# Altium project EEG.PrjPCB
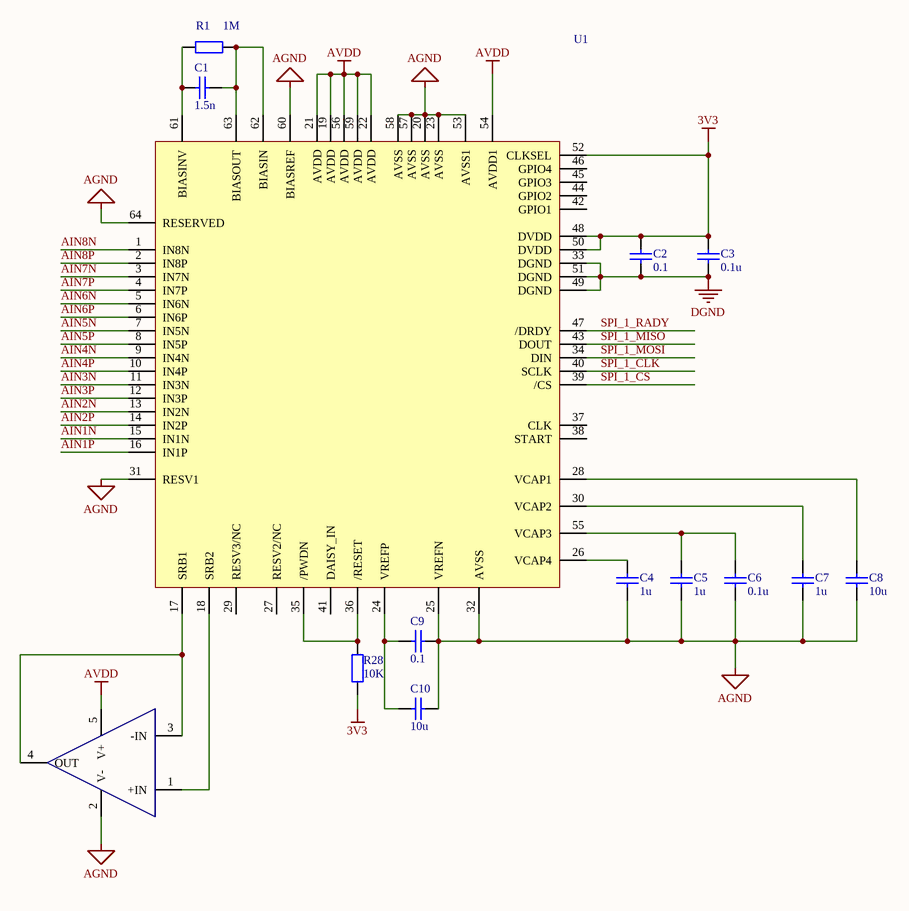
[diagram p0: ADC.SchDoc]
4 sheets, 89 parts. Net scope: global (net labels, ports and power ports of the same name join across sheets).
Sheets:
  ADC.SchDoc
  MPU.SchDoc
  INTERFACE.SchDoc
  Power.SchDoc

## Sheet ADC.SchDoc
size A4

### Parts
(Parts that share a designator on the sheet are numbered #1, #2 ... from top to bottom, then left to right.)
?#1  LTC2054MPS5  [S5]  (value not drawn)
C1  1.5n  [RAD-0.3]
C2  0.1  [CAP-C0603-H0.9mm]
C3  0.1u  [CAP-C0603-H0.9mm]
C4  1u  [CAP-C0603-H0.9mm]
C5  1u  [CAP-C0603-H0.9mm]
C6  0.1u  [CAP-C0603-H0.9mm]
C7  1u  [CAP-C0603-H0.9mm]
C8  10u  [CAP-C0603-H0.9mm]
C9  0.1  [CAP-C0603-H0.9mm]
C10  10u  [CAP-C0603-H0.9mm]
R1  1M  [RES-0805-H0.6mm]
R28  10K  [RES-0805-H0.6mm]
U1  ADS1299  [TQFP-64]  (value not drawn)

### Nets
3V3: C2.1 C2.2 C3.1 C3.2 R28.2 U1.33(DGND) U1.48(DVDD) U1.49(DGND) U1.50(DVDD) U1.51(DGND) U1.52(CLKSEL)  [also labelled DGND]  [project net CD]
AGND: ?#1.2(V-) C4.2 C5.2 C6.2 C7.2 C8.2 C9.1 C10.1 U1.20(AVSS) U1.23(AVSS) U1.25(VREFN) U1.31(RESV1) U1.32(AVSS) U1.53(AVSS1) U1.57(AVSS) U1.58(AVSS) U1.60(BIASREF) U1.64(RESERVED)
AVDD: ?#1.5(V+) U1.19(AVDD) U1.21(AVDD) U1.22(AVDD) U1.54(AVDD1) U1.56(AVDD) U1.59(AVDD)  [project net +2.5V]
AIN1N: U1.15(IN1N)
AIN1P: U1.16(IN1P)
AIN2N: U1.13(IN2N)
AIN2P: U1.14(IN2P)
AIN3N: U1.11(IN3N)
AIN3P: U1.12(IN3P)
AIN4N: U1.9(IN4N)
AIN4P: U1.10(IN4P)
AIN5N: U1.7(IN5N)
AIN5P: U1.8(IN5P)
AIN6N: U1.5(IN6N)
AIN6P: U1.6(IN6P)
AIN7N: U1.3(IN7N)
AIN7P: U1.4(IN7P)
AIN8N: U1.1(IN8N)
AIN8P: U1.2(IN8P)
SPI_1_CLK: U1.40(SCLK)
SPI_1_CS: U1.39(/CS)
SPI_1_MISO: U1.43(DOUT)
SPI_1_MOSI: U1.34(DIN)
SPI_1_RADY: U1.47(/DRDY)
Net?#1_1: ?#1.1(+IN) U1.18(SRB2)
Net?#1_3: ?#1.3(-IN) ?#1.4(OUT) U1.17(SRB1)
NetC1_1: C1.1 R1.2 U1.61(BIASINV)
NetC1_2: C1.2 R1.1 U1.62(BIASIN) U1.63(BIASOUT)
NetC4_1: C4.1 U1.26(VCAP4)
NetC5_1: C5.1 C6.1 U1.55(VCAP3)
NetC7_1: C7.1 U1.30(VCAP2)
NetC8_1: C8.1 U1.28(VCAP1)
NetC9_2: C9.2 C10.2 U1.24(VREFP)
NetR28_1: R28.1 U1.35(/PWDN) U1.36(/RESET)

Not connected (* = marked no-connect by the designer): U1 27(RESV2/NC) 29(RESV3/NC) 37(CLK) 38(START) 41(DAISY_IN) 42(GPIO1) 44(GPIO2) 45(GPIO3) 46(GPIO4)

### Library data of the parts
?#1 = OPA376DCK: IC OPAMP CHOPPER 500KHZ TSOT23-5; Manufacturer: Linear Technology/Analog Devices; Manufacturer Part Number: LTC2054MPS5#TRMPBF; Amplifier Type: Zero-Drift; Output Type: Rail-to-Rail; Slew Rate: 0.5 V/µs; Current - Supply: 145µA; Voltage - Supply, Single/Dual (±): 2.7 V ~ 6 V; Supplier 1: Digi-Key; RoHS: RoHS Compliant; Category: Integrated Circuits (ICs); Stock 1: 929; Pricing 1: 1=13.95, 25=12.454, 100=7.4993, 250=6.87432 (CAD); Packaging: Cut Tape (CT); Part Status: Active; Operating Temperature: -55°C ~ 150°C; Mounting Type: Surface Mount; Package / Case: SOT-23-5 Thin, TSOT-23-5; Supplier Device Package: TSOT-23-5; Base Part Number: LTC2054; ComponentLink1URL: http://www.linear.com/docs/5176; ComponentLink1Description: http://www.linear.com/docs/5176; Supplier Part Number 1: LTC2054MPS5#TRMPBFCT-ND
C1 = Cap: Capacitor
C2-C10 = C0603: CER 10UF 25V X8R 1210; Supplier 1: Digi-Key; Supplier Part Number 1: 445-174833-1-ND; digikey part number: 478-1244-1-ND; Parameter 1: *
R1 R28 = R: RES SMD 33 OHM 1% 1/10W 0603; CMT: 1k; Supplier 1: Digi-Key; Supplier Part Number 1: 311-33.0HRCT-ND
U1 = ADS1299: ComponentLink1Description: EEG BOARD; ComponentLink1URL: https://www.digikey.ca/products/en/development-boards-kits-programmers/evaluation-and-demonstration-boards-and-kits/787?k=ads1299; ComponentLink2Description: ADS1299; ComponentLink2URL: https://www.digikey.ca/product-detail/en/texas-instruments/ADS1299IPAGR/296-34818-1-ND/3536905; digikey: 296-34818-1-ND

## Sheet MPU.SchDoc
size A4
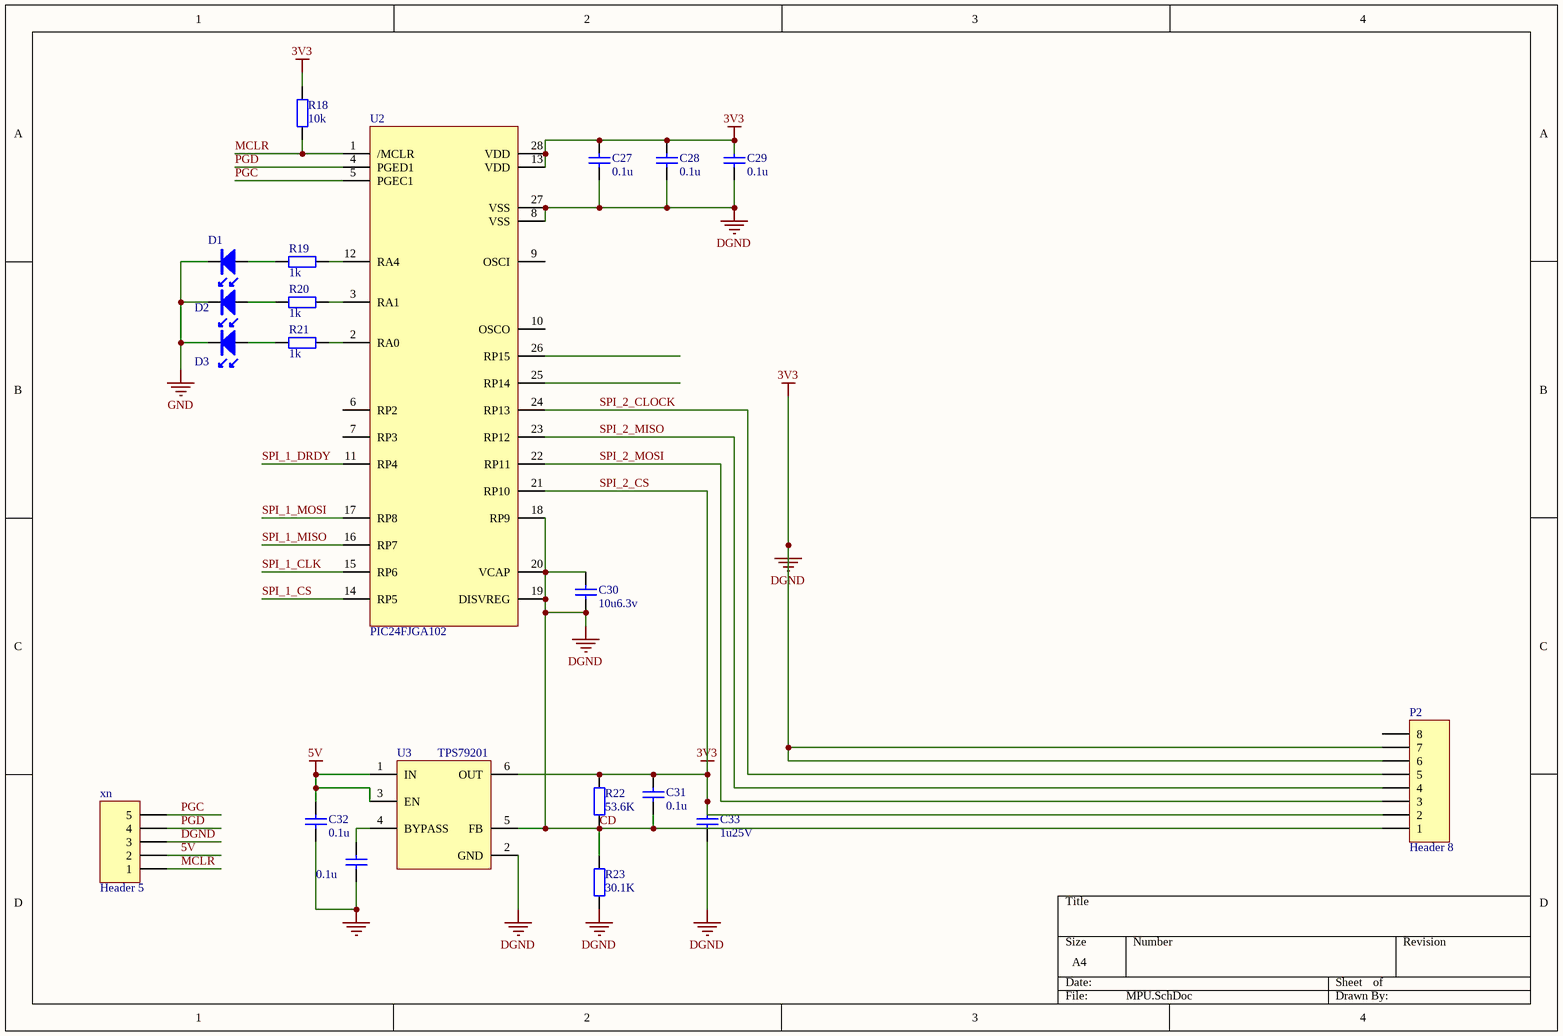
[diagram p1: MPU.SchDoc]

### Parts
(Parts that share a designator on the sheet are numbered #1, #2 ... from top to bottom, then left to right.)
?#2  0.1u  [CAP-C0603-H0.9mm]
C27  0.1u  [CAP-C1210-H2.2MM]
C28  0.1u  [CAP-C1210-H2.2MM]
C29  0.1u  [CAP-C1210-H2.2MM]
C30  10u6.3v  [CAP-C1210-H2.2MM]
C31  0.1u  [CAP-C0603-H0.9mm]
C32  0.1u  [CAP-C0603-H0.9mm]
C33  1u25V  [CAP-C1210-H2.2MM]
D1  LED  [LED0603]  (value not drawn)
D2  LED  [LED0603]  (value not drawn)
D3  LED  [LED0603]  (value not drawn)
P2  Header 8  [HDR1X8]
R18  10k  [RES-0805-H0.6mm]
R19  1k  [R0603]
R20  1k  [R0603]
R21  1k  [R0603]
R22  53.6K  [R0603]
R23  30.1K  [R0603]
U2  PIC24FJGA102
U3  TPS79201
xn  Header 5  [HDR1X5]

### Nets
5V: C32.2 U3.1(IN) U3.3(EN) xn.2
CD: C27.1 C27.2 C28.1 C28.2 C29.1 C29.2 C30.1 C30.2 C31.1 C31.2 C33.1 C33.2 P2.1 P2.2 P2.6 P2.7 R18.2 R22.1 R22.2 R23.1 R23.2 U2.8(VSS) U2.13(VDD) U2.18(RP9) U2.19(DISVREG) U2.20(VCAP) U2.21(RP10) U2.27(VSS) U2.28(VDD) U3.2(GND) U3.5(FB) U3.6(OUT) xn.3  [also labelled 3V3, DGND, SPI_2_CS]
GND: ?#2.1 C32.1 D1.K D2.K D3.K
MCLR: R18.1 U2.1(/MCLR) xn.1
PGC: U2.5(PGEC1) xn.5
PGD: U2.4(PGED1) xn.4
SPI_1_CLK: U2.15(RP6)
SPI_1_CS: U2.14(RP5)
SPI_1_DRDY: U2.11(RP4)
SPI_1_MISO: U2.16(RP7)
SPI_1_MOSI: U2.17(RP8)
SPI_2_CLOCK: P2.5 U2.24(RP13)
SPI_2_MISO: P2.4 U2.23(RP12)
SPI_2_MOSI: P2.3 U2.22(RP11)
Net?#2_2: ?#2.2 U3.4(BYPASS)
NetD1_A: D1.A R19.1
NetD2_A: D2.A R20.1
NetD3_A: D3.A R21.1
NetR19_2: R19.2 U2.12(RA4)
NetR20_2: R20.2 U2.3(RA1)
NetR21_2: R21.2 U2.2(RA0)

Not connected (* = marked no-connect by the designer): P2 8; U2 6(RP2) 7(RP3) 9(OSCI) 10(OSCO) 25(RP14) 26(RP15)

### Library data of the parts
?#2 C31 C32 = C0603: CAP CER 0.1UF 50V 10% X8R 0603; Supplier Part Number 1: 445-8818-1-ND
  ?#2: Supplier 1: Digi-Key
  C31: Supplier 1: Digi-Key; digikey part number: 478-1244-1-ND
  C32: digikey part number: 478-1244-1-ND
C27-C30 C33 = C0603: CER 10UF 25V X8R 1210
  C27-C29 C33: Supplier 1: Digi-Key; Supplier Part Number 1: 445-174833-1-ND
  C30: digikey part number: 445-11185-1-ND; ComponentLink1Description: digikey link; ComponentLink1URL: https://www.digikey.ca/product-detail/en/tdk-corporation/C1608JB0J106K080AB/445-11185-1-ND/3952851
D1-D3 = LED_RED_CLEAR_0603: LED GREEN CLEAR 0603 SMD; CMT: APT2012LVBC/D; Supplier 1: Digi-Key; Supplier Part Number 1: 732-4971-1-ND
P2 = Header 8: Header, 8-Pin; ComponentLink1Description: digikey link; ComponentLink1URL: https://www.digikey.ca/product-detail/en/adafruit-industries-llc/254/1528-1462-ND/5761230; digikey  part number: 1528-1462-ND
R18 = R: RES SMD 33 OHM 1% 1/10W 0603; CMT: 1k; Supplier 1: Digi-Key; Supplier Part Number 1: 311-33.0HRCT-ND
R19-R21 = R0603M: 1K OHM 1% 1/10W 0603; Supplier 1: Digi-Key; Supplier Part Number 1: 311-1.00KHRCT-ND; CMT: 1k
R22 = R0603M: 169k OHM 1% 1/10W 0603; CMT: 100k; Supplier 1: Digi-Key; Supplier Part Number 1: 311-174KHRCT-ND
R23 = R0603M: SMD 39K OHM 1% 1/10W 0603; CMT: 31.6k; Supplier 1: Digi-Key; Supplier Part Number 1: P39.0KHCT-ND
xn = Header 5: Header, 5-Pin; digkey part number: AE10383-ND; ComponentLink2Description: digigkey link; ComponentLink2URL: https://www.digikey.ca/product-detail/en/assmann-wsw-components/A-2004-1-4-LP-N-R/AE10383-ND/2183634
U2 = PIC24FJGA102: ComponentLink1Description: digikey link; ComponentLink1URL: https://www.digikey.ca/product-detail/en/microchip-technology/PIC24FJ64GA102-I-SS/PIC24FJ64GA102-I-SS-ND/2651318; digikey part number: PIC24FJ64GA102-I/SS-ND
U3 = TPS79201: digikey part number: 296-11868-1-ND

## Sheet INTERFACE.SchDoc
size A4
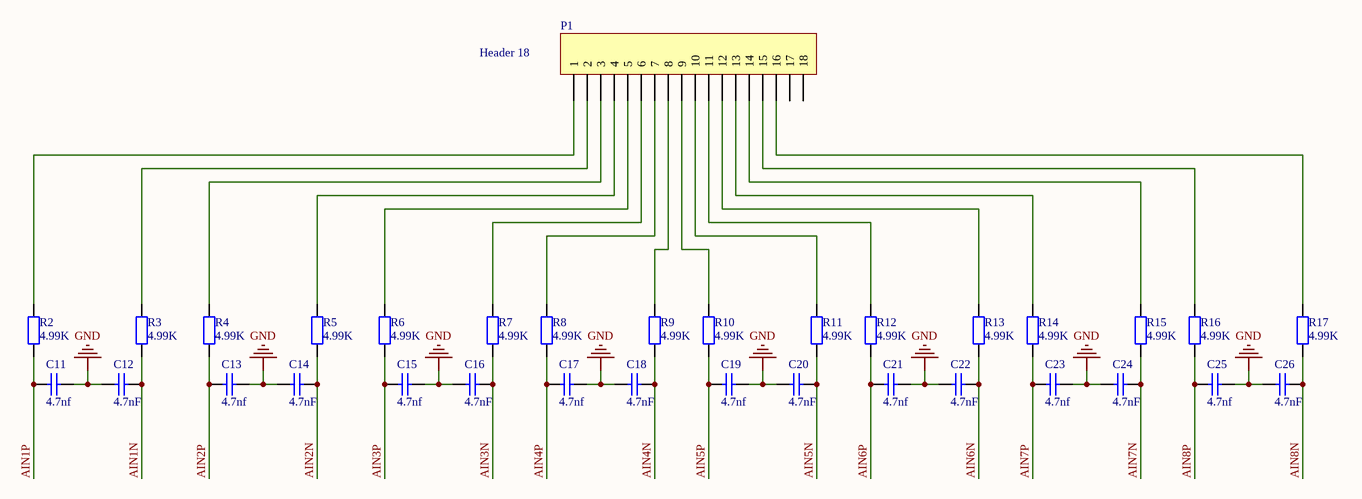
[diagram p2: INTERFACE.SchDoc]

### Parts
C11  4.7nf  [CAP-C0603-H0.9mm]
C12  4.7nF  [CAP-C0603-H0.9mm]
C13  4.7nf  [CAP-C0603-H0.9mm]
C14  4.7nF  [CAP-C0603-H0.9mm]
C15  4.7nf  [CAP-C0603-H0.9mm]
C16  4.7nF  [CAP-C0603-H0.9mm]
C17  4.7nf  [CAP-C0603-H0.9mm]
C18  4.7nF  [CAP-C0603-H0.9mm]
C19  4.7nf  [CAP-C0603-H0.9mm]
C20  4.7nF  [CAP-C0603-H0.9mm]
C21  4.7nf  [CAP-C0603-H0.9mm]
C22  4.7nF  [CAP-C0603-H0.9mm]
C23  4.7nf  [CAP-C0603-H0.9mm]
C24  4.7nF  [CAP-C0603-H0.9mm]
C25  4.7nf  [CAP-C0603-H0.9mm]
C26  4.7nF  [CAP-C0603-H0.9mm]
P1  Header 18  [HDR1X18]
R2  4.99K  [RES-0805-H0.6mm]
R3  4.99K  [RES-0805-H0.6mm]
R4  4.99K  [RES-0805-H0.6mm]
R5  4.99K  [RES-0805-H0.6mm]
R6  4.99K  [RES-0805-H0.6mm]
R7  4.99K  [RES-0805-H0.6mm]
R8  4.99K  [RES-0805-H0.6mm]
R9  4.99K  [RES-0805-H0.6mm]
R10  4.99K  [RES-0805-H0.6mm]
R11  4.99K  [RES-0805-H0.6mm]
R12  4.99K  [RES-0805-H0.6mm]
R13  4.99K  [RES-0805-H0.6mm]
R14  4.99K  [RES-0805-H0.6mm]
R15  4.99K  [RES-0805-H0.6mm]
R16  4.99K  [RES-0805-H0.6mm]
R17  4.99K  [RES-0805-H0.6mm]

### Nets
GND: C11.1 C12.2 C13.1 C14.2 C15.1 C16.2 C17.1 C18.2 C19.1 C20.2 C21.1 C22.2 C23.1 C24.2 C25.1 C26.2
AIN1N: C12.1 R3.1
AIN1P: C11.2 R2.1
AIN2N: C14.1 R5.1
AIN2P: C13.2 R4.1
AIN3N: C16.1 R7.1
AIN3P: C15.2 R6.1
AIN4N: C18.1 R9.1
AIN4P: C17.2 R8.1
AIN5N: C20.1 R11.1
AIN5P: C19.2 R10.1
AIN6N: C22.1 R13.1
AIN6P: C21.2 R12.1
AIN7N: C24.1 R15.1
AIN7P: C23.2 R14.1
AIN8N: C26.1 R17.1
AIN8P: C25.2 R16.1
NetP1_1: P1.1 R2.2
NetP1_2: P1.2 R3.2
NetP1_3: P1.3 R4.2
NetP1_4: P1.4 R5.2
NetP1_5: P1.5 R6.2
NetP1_6: P1.6 R7.2
NetP1_7: P1.7 R8.2
NetP1_8: P1.8 R9.2
NetP1_9: P1.9 R10.2
NetP1_10: P1.10 R11.2
NetP1_11: P1.11 R12.2
NetP1_12: P1.12 R13.2
NetP1_13: P1.13 R14.2
NetP1_14: P1.14 R15.2
NetP1_15: P1.15 R16.2
NetP1_16: P1.16 R17.2

Not connected (* = marked no-connect by the designer): P1 17 18

### Library data of the parts
C11-C26 = C0603: CER 10UF 25V X8R 1210; Supplier 1: Digi-Key; Supplier Part Number 1: 445-174833-1-ND; digikey part number: 478-1244-1-ND; Parameter 1: *
P1 = Header 18: Header, 18-Pin; LatestRevisionDate: 17-Jul-2002; LatestRevisionNote: Re-released for DXP Platform.; Publisher: Altium Limited
R2-R17 = R: RES SMD 33 OHM 1% 1/10W 0603; CMT: 1k; Supplier 1: Digi-Key; Supplier Part Number 1: 311-33.0HRCT-ND

## Sheet Power.SchDoc
size A4
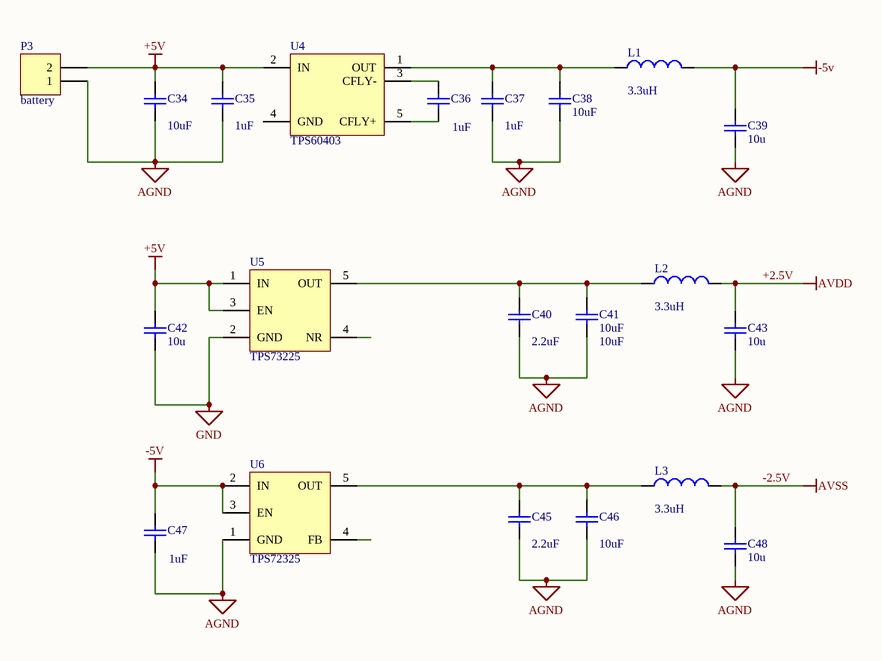
[diagram p3: Power.SchDoc]

### Parts
C34  value 10uF  [RAD-0.3]
C35  value 1uF  [RAD-0.3]
C36  value 1uF  [RAD-0.3]
C37  value 1uF  [RAD-0.3]
C38  10uF  [RAD-0.3]
C39  10u  [RAD-0.3]
C40  value 2.2uF  [RAD-0.3]
C41  10uF  [RAD-0.3]
C42  10u  [RAD-0.3]
C43  10u  [RAD-0.3]
C45  value 2.2uF  [RAD-0.3]  (hidden comment: Cap)
C46  value 10uF  [RAD-0.3]  (hidden comment: Cap)
C47  value 1uF  [RAD-0.3]
C48  10u  [RAD-0.3]
L1  value 3.3uH  [0402-A]
L2  value 3.3uH  [0402-A]
L3  value 3.3uH  [0402-A]  (hidden comment: Inductor)
P3  battery  [HDR1X2]
U4  TPS60403
U5  TPS73225
U6  TPS72325

### Nets
+2.5V: C43.2 L2.2  [also labelled AVDD]
+5V: C34.2 C35.2 C42.2 P3.2 U4.2(IN) U5.1(IN) U5.3(EN)
-2.5V: C48.2 L3.2  [also labelled AVSS]
-5V: C39.2 C47.2 L1.2 U6.2(IN) U6.3(EN)
AGND: C34.1 C35.1 C37.1 C38.1 C39.1 C40.1 C41.1 C43.1 C45.1 C46.1 C47.1 C48.1 P3.1 U6.1(GND)
GND: C42.1 U5.2(GND)
NetC36_1: C36.1 U4.5(CFLY+)
NetC36_2: C36.2 U4.3(CFLY-)
NetC37_2: C37.2 C38.2 L1.1 U4.1(OUT)
NetC40_2: C40.2 C41.2 L2.1 U5.5(OUT)
NetC45_2: C45.2 C46.2 L3.1 U6.5(OUT)

Not connected (* = marked no-connect by the designer): U4 4(GND); U5 4(NR); U6 4(FB)

### Library data of the parts
C34-C43 C45-C48 = Cap: Capacitor
  C35 C37 C40 C45 C46: Published: 8-Jun-2000; LatestRevisionDate: 17-Jul-2002; LatestRevisionNote: Re-released for DXP Platform.; PackageReference: RAD-0.3; Publisher: Altium Limited; PackageDescription: Radial Cap, Thru-Hole; 2 Leads; 0.3 in Pin Spacing
  C38: Published: 8-Jun-2000; LatestRevisionDate: 17-Jul-2002; LatestRevisionNote: Re-released for DXP Platform.; PackageReference: RAD-0.3; Publisher: Altium Limited; PackageDescription: Radial Cap, Thru-Hole; 2 Leads; 0.3 in Pin Spacing; Value: 10uF
  C39 C42 C43 C48: LatestRevisionNote: Re-released for DXP Platform.; Publisher: Altium Limited
  C41: LatestRevisionNote: Re-released for DXP Platform.; PackageReference: RAD-0.3; PackageDescription: Radial Cap, Thru-Hole; 2 Leads; 0.3 in Pin Spacing; Value: 10uF; Parameter 1: *
  C47: Publisher: Altium Limited
L1 L2 = Inductor: Code_IEC: 1005; Published: 8-Jun-2000; LatestRevisionDate: 29-May-2009; LatestRevisionNote: IPC-7351 Footprint Added.; PackageReference: 0402-A; Publisher: Altium Limited; PackageDescription: Chip Inductor; Code_JEITA: 0402
P3 = Header 2: Header, 2-Pin; Publisher: Altium Limited
L3 = Inductor: Publisher: Altium Limited
U4 = TPS60403: ComponentLink1Description: link; ComponentLink1URL: https://www.digikey.ca/product-detail/en/texas-instruments/TPS60403DBVR/296-27005-1-ND/2255295; digikey part number: https://www.digikey.ca/product-detail/en/texas-instruments/TPS60403DBVR/296-27005-1-ND/2255295; Parameter 1: *
U5 = TPS73225: digikey part number: 296-15810-1-ND; ComponentLink1Description: link; ComponentLink1URL: https://www.digikey.ca/product-detail/en/texas-instruments/TPS73225DBVT/296-15810-1-ND/604364
U6 = TPS72325: digikey part number: 296-39479-1-ND; ComponentLink1Description: link; ComponentLink1URL: https://www.digikey.ca/product-detail/en/texas-instruments/TPS72325DBVR/296-39479-1-ND/5143427

## Nets that join several sheets
+2.5V: ADC (7 pins), Power (C43.2 L2.2)
AGND: ADC (18 pins), Power (14 pins)
CD: ADC (11 pins), MPU (33 pins)
GND: MPU (5 pins), INTERFACE (16 pins), Power (C42.1 U5.2)
AIN1N: ADC (U1.15), INTERFACE (C12.1 R3.1)
AIN1P: ADC (U1.16), INTERFACE (C11.2 R2.1)
AIN2N: ADC (U1.13), INTERFACE (C14.1 R5.1)
AIN2P: ADC (U1.14), INTERFACE (C13.2 R4.1)
AIN3N: ADC (U1.11), INTERFACE (C16.1 R7.1)
AIN3P: ADC (U1.12), INTERFACE (C15.2 R6.1)
AIN4N: ADC (U1.9), INTERFACE (C18.1 R9.1)
AIN4P: ADC (U1.10), INTERFACE (C17.2 R8.1)
AIN5N: ADC (U1.7), INTERFACE (C20.1 R11.1)
AIN5P: ADC (U1.8), INTERFACE (C19.2 R10.1)
AIN6N: ADC (U1.5), INTERFACE (C22.1 R13.1)
AIN6P: ADC (U1.6), INTERFACE (C21.2 R12.1)
AIN7N: ADC (U1.3), INTERFACE (C24.1 R15.1)
AIN7P: ADC (U1.4), INTERFACE (C23.2 R14.1)
AIN8N: ADC (U1.1), INTERFACE (C26.1 R17.1)
AIN8P: ADC (U1.2), INTERFACE (C25.2 R16.1)
SPI_1_CLK: ADC (U1.40), MPU (U2.15)
SPI_1_CS: ADC (U1.39), MPU (U2.14)
SPI_1_MISO: ADC (U1.43), MPU (U2.16)
SPI_1_MOSI: ADC (U1.34), MPU (U2.17)